# Altium project LPL_Control_board_Rev3.PrjPcb (part 2 of 2)
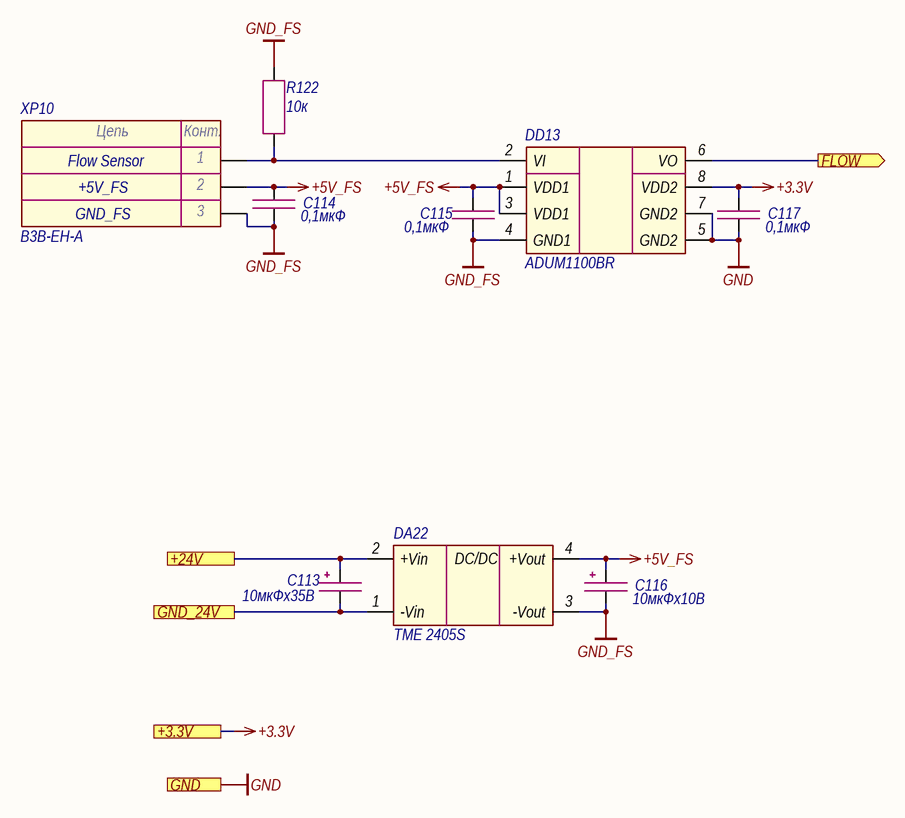
[diagram p11: Flow_sensor.SchDoc]

## Nets that join several sheets
+3.3V: Main (20 pins), Hardwiring (13 pins), Ethernet (10 pins), Power_supply (7 pins), A6 (7 pins), Fiber_interlock (C75.1 DD8.5 R57.2), Flow_sensor (C117.1 DD13.8), A7 (7 pins)
+3.3VA: Main (6 pins), A1 (C32A1.1 C33A1.1 DA4A1.4 R19A1.3), A3 (R20A3.1), A6 (C51A6.1 DA8A6.5), A2 (C32A2.1 C33A2.1 DA4A2.4 R19A2.3), A4 (R20A4.1), A11 (C32A11.1 C33A11.1 DA4A11.4 R19A11.3), A7 (C51A7.1 DA8A7.5)
+5V: Main (5 pins), Guide_laser (5 pins)
+5VA: Main (C4.1 L1.2), Hardwiring (C97.1 C100.1 DA18.2 U6.8), A1 (C28A1.1 C29A1.1 DA3A1.7 DA3A1.8), A6 (6 pins), A2 (C28A2.1 C29A2.1 DA3A2.7 DA3A2.8), A11 (C28A11.1 C29A11.1 DA3A11.7 DA3A11.8), A7 (6 pins)
+24V: Main (C1.1 DA1.2 XP2.1), Indication (XP7.1 XP7.3 XP7.5), Hardwiring (C104.1 DA19.2), Power_supply (C36.1 DA5.2), A6 (C50A6.1 DA11A6.2), Flow_sensor (C113.1 DA22.2), A7 (C50A7.1 DA11A7.2)
-5VA: Main (5 pins), A1 (C26A1.2 C27A1.1 DA3A1.4), A2 (C26A2.2 C27A2.1 DA3A2.4), A11 (C26A11.2 C27A11.1 DA3A11.4)
AGND: Main (13 pins), Hardwiring (6 pins), A1 (14 pins), A3 (C34A3.2), A6 (13 pins), A2 (14 pins), A4 (C34A4.2), A11 (14 pins), A7 (13 pins)
GND: Main (40 pins), Indication (U3.2 U4.2 U5.2), Hardwiring (16 pins), Ethernet (31 pins), Power_supply (9 pins), A6 (8 pins), Guide_laser (8 pins), Fiber_interlock (C74.2 C75.2 DD8.3 XP8.2), Flow_sensor (C117.2 DD13.5 DD13.7), A7 (8 pins)
GND_24V: Main (C1.2 DA1.1 XP2.2), Indication (U3.3 U4.3 U5.3), Hardwiring (C104.2 DA19.1), Power_supply (C36.2 DA5.1), A6 (C50A6.2 DA11A6.1), Flow_sensor (C113.2 DA22.1), A7 (C50A7.2 DA11A7.1)
CRASH_IND: Main (DD1.3), Indication (R55.2)
DRV1_AN_MOD: Main (DD1.63), A6 (R31A6.1)
DRV1_CUR: Main (DD1.30), A6 (C69A6.2 DA14A6.1 R45A6.1)
DRV1_DIG_MOD: Main (DD1.61), A6 (DA10A6.3)
DRV1_ERR1: Main (DD1.55), A6 (DD7A6.5)
DRV1_ERR2: Main (DD1.56), A6 (DD7A6.6)
DRV1_ON: Main (DD1.52), A6 (DD7A6.3)
DRV1_SEL_AN: Main (DD1.54), A6 (DA8A6.6)
DRV1_SEL_DIG: Main (DD1.53), A6 (DA10A6.6)
DRV2_AN_MOD: Main (DD1.64), A7 (R31A7.1)
DRV2_CUR: Main (DD1.31), A7 (C69A7.2 DA14A7.1 R45A7.1)
DRV2_DIG_MOD: Main (DD1.62), A7 (DA10A7.3)
DRV2_ERR1: Main (DD1.60), A7 (DD7A7.5)
DRV2_ERR2: Main (DD1.65), A7 (DD7A7.6)
DRV2_ON: Main (DD1.57), A7 (DD7A7.3)
DRV2_SEL_AN: Main (DD1.59), A7 (DA8A7.6)
DRV2_SEL_DIG: Main (DD1.58), A7 (DA10A7.6)
EMIS_IND: Main (DD1.2), Indication (R54.2)
ETH_CS: Main (DD1.92), Ethernet (DD9.29)
ETH_INT: Main (DD1.88), Ethernet (DD9.47)
ETH_MISO: Main (DD1.90), Ethernet (DD9.33)
ETH_MOSI: Main (DD1.91), Ethernet (DD9.32)
ETH_RST: Main (DD1.93), Ethernet (DD9.48 R72.1)
ETH_SCLK: Main (DD1.89), Ethernet (DD9.30)
EXT_AN_MOD: Main (DD1.32), Hardwiring (C102.2 DA18.1 R100.1), A6 (DA8A6.1), A7 (DA8A7.1)
EXT_COM1: Main (DD1.39), Hardwiring (DD11.13)
EXT_COM2: Main (DD1.41), Hardwiring (DD11.12)
EXT_COM3: Main (DD1.42), Hardwiring (DD11.11)
EXT_DIG_MOD: Main (DD1.40), Hardwiring (DD11.14), A6 (DA10A6.1), A7 (DA10A7.1)
EXT_FLAG1: Main (DD1.43), Hardwiring (R101.2)
EXT_FLAG2: Main (DD1.44), Hardwiring (R102.2)
EXT_FLAG3: Main (DD1.45), Hardwiring (R103.2)
EXT_FLAG4: Main (DD1.46), Hardwiring (R104.2)
EXT_IL1: Main (DD1.33), Hardwiring (R93.2 U7.16)
EXT_IL2: Main (DD1.34), Hardwiring (R94.2 U7.14)
EXT_KEY: Main (DD1.36), Hardwiring (R96.2 U7.12)
EXT_MP_EN: Main (DD1.38), Hardwiring (R97.2 U7.10)
EXT_PMO: Main (DD1.35), Hardwiring (DD12.2)
FIBER_IL: Main (DD1.82), Fiber_interlock (DD8.4)
FLOW: Main (DD1.77), Flow_sensor (DD13.6)
GUIDE_LAS: Main (DD1.4), Guide_laser (R46.1)
PD1: Main (XP1.1), A11 (C25A11.2 DA3A11.2 R14A11.1)
PD1_ADC: Main (DD1.25), A11 (C30A11.1 R17A11.2)
PD1_ERR: Main (DD1.16), A11 (DA4A11.5)
PD2: Main (XP1.3), A2 (C25A2.2 DA3A2.2 R14A2.1)
PD2_ADC: Main (DD1.24), A2 (C30A2.1 R17A2.2)
PD2_ERR: Main (DD1.17), A2 (DA4A2.5)
PD3: Main (XP1.5), A1 (C25A1.2 DA3A1.2 R14A1.1)
PD3_ADC: Main (DD1.23), A1 (C30A1.1 R17A1.2)
PD3_ERR: Main (DD1.18), A1 (DA4A1.5)
POWER_IND: Main (DD1.1), Indication (R53.2)
PS_A: Main (DD1.96), Power_supply (DD3.3)
PS_D: Main (DD1.95), Power_supply (DD3.2)
PS_ERR1: Main (DD1.66), Power_supply (DD5.14)
PS_ERR2: Main (DD1.67), Power_supply (DD5.13)
PS_ERR3: Main (DD1.68), Power_supply (DD5.12)
PS_ON: Main (DD1.69), Power_supply (DD5.11)
RE/DE: Main (DD1.51), Hardwiring (DD10.4 DD10.5)
Rx485: Main (DD1.48), Hardwiring (DD10.3)
RxCAN: Main (DD1.70), Power_supply (DD6.5)
T1: Main (XP1.7), A3 (R20A3.2 R21A3.1)
T1_ADC: Main (DD1.26), A3 (C34A3.1 R21A3.2)
T2: Main (XP1.9), A4 (R20A4.2 R21A4.1)
T2_ADC: Main (DD1.29), A4 (C34A4.1 R21A4.2)
Tx485: Main (DD1.47), Hardwiring (DD10.6)
TxCAN: Main (DD1.71), Power_supply (DD6.6)